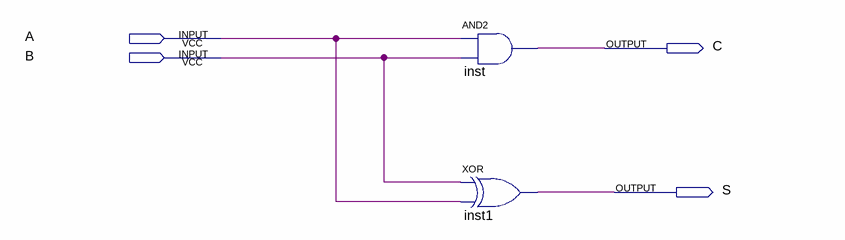
[diagram p0: schematic sheet]
// Quartus schematic HA.bdf as structural Verilog: 2 symbols, 4 pins
module HA (
  input  A,
  input  B,
  output C,
  output S
);

  and inst (C, A, B);
  xor inst1 (S, B, A);
endmodule
